# Altium project LimeSDR-PCIe_1v2.PrjPcb (part 4 of 6)

## Sheet 13_Periphs.SchDoc: Peripherals
size A3; Organization: Lime Microsystems; Address1: Surrey Tech Centre; Address2: Guildford GU2 7YG; Address3: Surrey; Address4: United Kingdom; Revision: v1.2; SheetNumber: 13; SheetTotal: 16
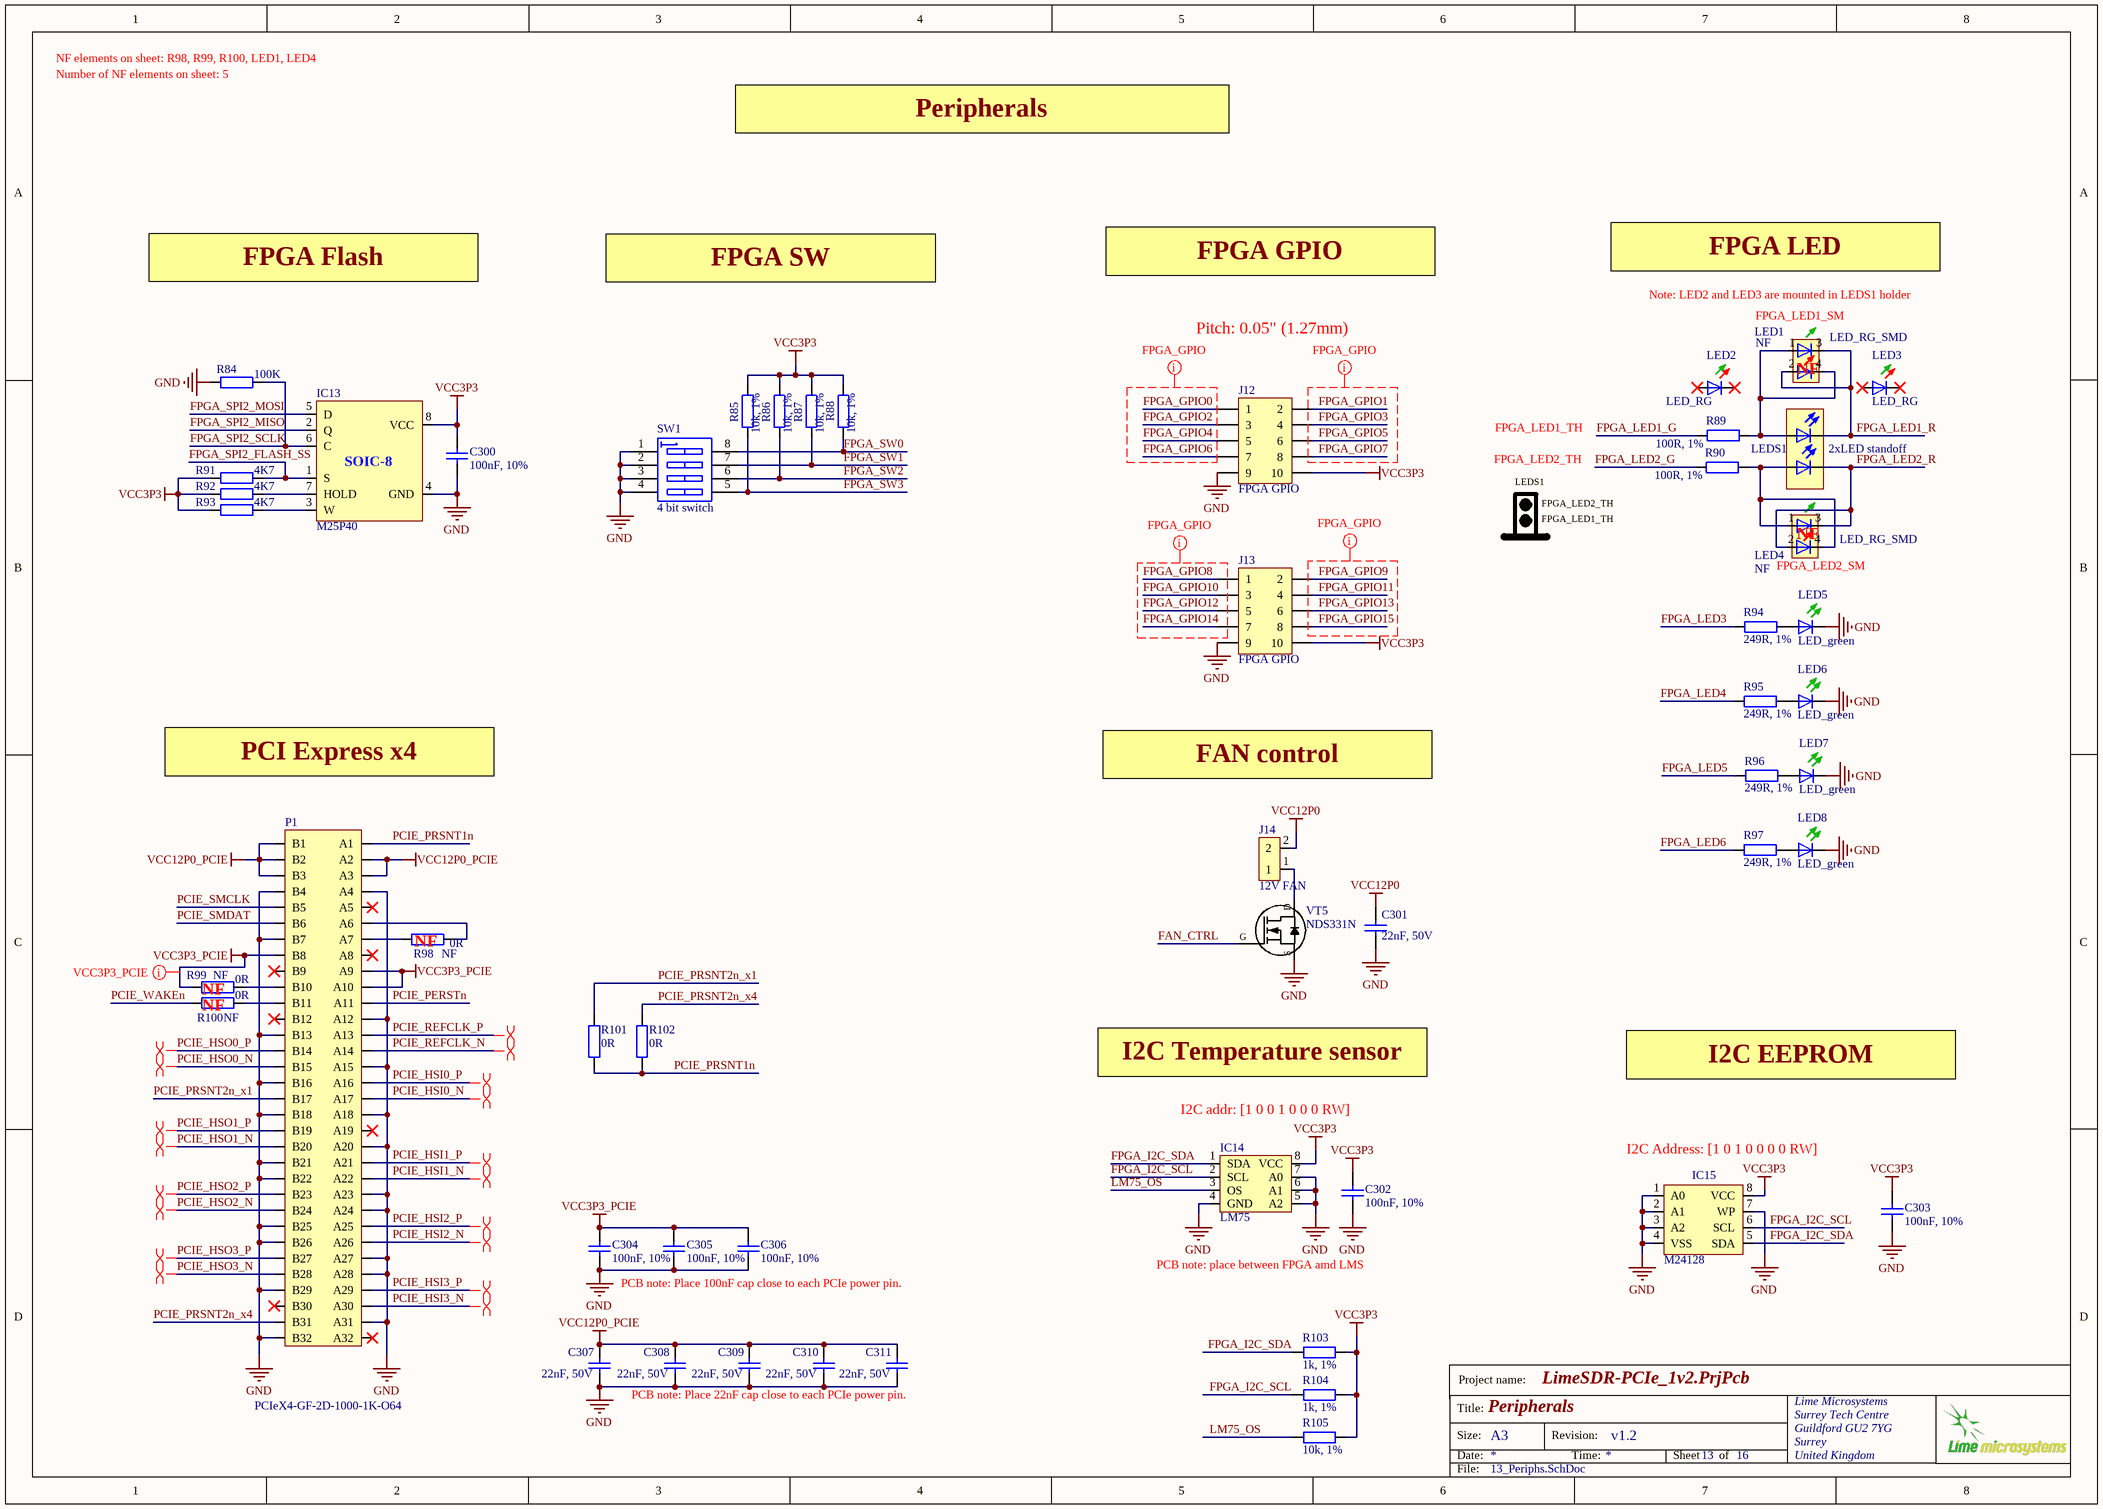
[diagram p13: 13_Periphs.SchDoc]

### Parts
C300  100nF, 10%  [CAP0402]
C301  22nF, 50V  [CAP0402]
C302  100nF, 10%  [CAP0402]
C303  100nF, 10%  [CAP0402]
C304  100nF, 10%  [CAP0402]
C305  100nF, 10%  [CAP0402]
C306  100nF, 10%  [CAP0402]
C307  22nF, 50V  [CAP0402]
C308  22nF, 50V  [CAP0402]
C309  22nF, 50V  [CAP0402]
C310  22nF, 50V  [CAP0402]
C311  22nF, 50V  [CAP0402]
IC13  M25P40  [M25P40-VMN6TPB_SO8N]
IC14  LM75  [HWSON8_LM75]
IC15  M24128  [24FC512]
J12  FPGA GPIO  [SWD_10_pin]
J13  FPGA GPIO  [SWD_10_pin]
J14  12V FAN  [HDR_1x2]
LED1  LED_RG_SMD  Assembly Info: NF  [LED-2x0603]
LED2  LED_RG  (mechanical)
LED3  LED_RG  (mechanical)
LED4  LED_RG_SMD  Assembly Info: NF  [LED-2x0603]
LED5  LED_green  [LED-0603-GREEN]
LED6  LED_green  [LED-0603-GREEN]
LED7  LED_green  [LED-0603-GREEN]
LED8  LED_green  [LED-0603-GREEN]
LEDS1  2xLED standoff  [LED_STANDOFF_H-201C]
P1  PCIeX4-GF-2D-1000-1K-O64  [PCIeX4-GF-2D-1000-1K-O64]  (no BOM)
R84  100K  [RES0402]
R85  10k, 1%  [RES0402]
R86  10k, 1%  [RES0402]
R87  10k, 1%  [RES0402]
R88  10k, 1%  [RES0402]
R89  100R, 1%  [RES0402]
R90  100R, 1%  [RES0402]
R91  4K7  [RES0402]
R92  4K7  [RES0402]
R93  4K7  [RES0402]
R94  249R, 1%  [RES0402]
R95  249R, 1%  [RES0402]
R96  249R, 1%  [RES0402]
R97  249R, 1%  [RES0402]
R98  0R  Assembly Info: NF  [RES0402]
R99  0R  Assembly Info: NF  [RES0402]
R100  0R  Assembly Info: NF  [RES0402]
R101  0R  [RES0402]
R102  0R  [RES0402]
R103  1k, 1%  [RES0402]
R104  1k, 1%  [RES0402]
R105  10k, 1%  [RES0402]
SW1  4 bit switch  [SW_4WAY_SMD_1P27]
VT5  NDS331N  [SOT23-3]

### Nets
GND: C300.2 C301.2 C302.2 C303.2 C304.2 C305.2 C306.2 C307.2 C308.2 C309.2 C310.2 C311.2 IC13.4(GND) IC14.4(GND) IC14.5(A2) IC14.6(A1) IC14.7(A0) IC15.1(A0) IC15.2(A1) IC15.3(A2) IC15.4(VSS) IC15.7(WP) J12.9 J13.9 LED5.K(C) LED6.K(C) LED7.K(C) LED8.K(C) P1.A4 P1.A12 P1.A15 P1.A18 P1.A20 P1.A23 P1.A24 P1.A27 P1.A28 P1.A31 P1.B4 P1.B7 P1.B13 P1.B16 P1.B18 P1.B21 P1.B22 P1.B25 P1.B26 P1.B29 P1.B32 R84.1 SW1.1(A1) SW1.2(A2) SW1.3(A3) SW1.4(A4) VT5.S
VCC3P3: C300.1 C302.1 C303.1 IC13.8(VCC) IC14.8(VCC) IC15.8(VCC) J12.10 J13.10 R85.1 R86.1 R87.1 R88.1 R91.1 R92.1 R93.1 R103.1 R104.1 R105.1
VCC3P3_PCIE: C304.1 C305.1 C306.1 P1.A9 P1.A10 P1.B8 R99.1
VCC12P0: C301.1 J14.2
VCC12P0_PCIE: C307.1 C308.1 C309.1 C310.1 C311.1 P1.A2 P1.A3 P1.B1 P1.B2 P1.B3
FAN_CTRL: VT5.G
FPGA_GPIO0: J12.1
FPGA_GPIO1: J12.2
FPGA_GPIO2: J12.3
FPGA_GPIO3: J12.4
FPGA_GPIO4: J12.5
FPGA_GPIO5: J12.6
FPGA_GPIO6: J12.7
FPGA_GPIO7: J12.8
FPGA_GPIO8: J13.1
FPGA_GPIO9: J13.2
FPGA_GPIO10: J13.3
FPGA_GPIO11: J13.4
FPGA_GPIO12: J13.5
FPGA_GPIO13: J13.6
FPGA_GPIO14: J13.7
FPGA_GPIO15: J13.8
FPGA_I2C_SCL: IC14.2(SCL) IC15.6(SCL) R104.2
FPGA_I2C_SDA: IC14.1(SDA) IC15.5(SDA) R103.2
FPGA_LED1_G: R89.1
FPGA_LED1_R: LED1.2 LED1.3 LEDS1.K1(C)
FPGA_LED2_G: R90.1
FPGA_LED2_R: LED4.2 LED4.3 LEDS1.K2(C)
FPGA_LED3: R94.1
FPGA_LED4: R95.1
FPGA_LED5: R96.1
FPGA_LED6: R97.1
FPGA_SPI2_FLASH_SS: IC13.1(S) R91.2
FPGA_SPI2_MISO: IC13.2(Q)
FPGA_SPI2_MOSI: IC13.5(D)
FPGA_SPI2_SCLK: IC13.6(C) R84.2
FPGA_SW0: R88.2 SW1.8(B1)
FPGA_SW1: R87.2 SW1.7(B2)
FPGA_SW2: R86.2 SW1.6(B3)
FPGA_SW3: R85.2 SW1.5(B4)
LM75_OS: IC14.3(OS) R105.2
PCIE_HSI0_N: P1.A17
PCIE_HSI0_P: P1.A16
PCIE_HSI1_N: P1.A22
PCIE_HSI1_P: P1.A21
PCIE_HSI2_N: P1.A26
PCIE_HSI2_P: P1.A25
PCIE_HSI3_N: P1.A30
PCIE_HSI3_P: P1.A29
PCIE_HSO0_N: P1.B15
PCIE_HSO0_P: P1.B14
PCIE_HSO1_N: P1.B20
PCIE_HSO1_P: P1.B19
PCIE_HSO2_N: P1.B24
PCIE_HSO2_P: P1.B23
PCIE_HSO3_N: P1.B28
PCIE_HSO3_P: P1.B27
PCIE_PERSTn: P1.A11
PCIE_PRSNT1n: P1.A1 R101.1 R102.1
PCIE_PRSNT2n_x1: P1.B17 R101.2
PCIE_PRSNT2n_x4: P1.B31 R102.2
PCIE_REFCLK_N: P1.A14
PCIE_REFCLK_P: P1.A13
PCIE_SMCLK: P1.B5
PCIE_SMDAT: P1.B6
PCIE_WAKEn: R100.1
NetIC13_3: IC13.3(W) R93.2
NetIC13_7: IC13.7(HOLD) R92.2
NetJ14_1: J14.1 VT5.D
NetLED1_1: LED1.1 LED1.4 LEDS1.A1(A) R89.2
NetLED4_1: LED4.1 LED4.4 LEDS1.A2(A) R90.2
NetLED5_A: LED5.A R94.2
NetLED6_A: LED6.A R95.2
NetLED7_A: LED7.A R96.2
NetLED8_A: LED8.A R97.2
NetP1_A6: P1.A6 R98.2
NetP1_A7: P1.A7 R98.1
NetP1_B10: P1.B10 R99.2
NetP1_B11: P1.B11 R100.2

Not connected (* = marked no-connect by the designer): LED2 A* K(C)*; LED3 A* K(C)*; P1 A5* A8* A19* A32* B9* B12* B30*

### Layout directives
net class FPGA_GPIO: FPGA_GPIO0, FPGA_GPIO1, FPGA_GPIO2, FPGA_GPIO3, FPGA_GPIO4, FPGA_GPIO5, FPGA_GPIO6, FPGA_GPIO7, FPGA_GPIO8, FPGA_GPIO9, FPGA_GPIO10, FPGA_GPIO11, FPGA_GPIO12, FPGA_GPIO13, FPGA_GPIO14, FPGA_GPIO15
differential pair: PCIE_HSI0_N, PCIE_HSI0_P, PCIE_HSI1_N, PCIE_HSI1_P, PCIE_HSI2_N, PCIE_HSI2_P, PCIE_HSI3_N, PCIE_HSI3_P, PCIE_HSO0_N, PCIE_HSO0_P, PCIE_HSO1_N, PCIE_HSO1_P, PCIE_HSO2_N, PCIE_HSO2_P, PCIE_HSO3_N, PCIE_HSO3_P, PCIE_REFCLK_N, PCIE_REFCLK_P
net class VCC3P3_PCIE: VCC3P3_PCIE

### Notes on the sheet
- Number of NF elements on sheet: 5
- NF elements on sheet: R98, R99, R100, LED1, LED4
- Peripherals
- FPGA Flash
- FPGA SW
- FPGA GPIO
- FPGA LED
- (near LED1) Note: LED2 and LED3 are mounted in LEDS1 holder
- Pitch: 0.05" (1.27mm)
- (near LED1) FPGA_LED1_SM
- (near LED1) NF
- FPGA_LED1_TH
- FPGA_LED2_TH
- LEDS1
- (near LED4) FPGA_LED2_SM
- (near LED4) NF
- PCI Express x4
- FAN control
- (near R98) NF
- (near R100) NF
- (near R99) NF
- I2C Temperature sensor
- I2C addr: [1 0 0 1 0 0 0 RW]
- I2C EEPROM
- (near IC15) I2C Address: [1 0 1 0 0 0 0 RW]
- PCB note: Place 100nF cap close to each PCIe power pin.
- PCB note: place between FPGA amd LMS
- PCB note: Place 22nF cap close to each PCIe power pin.
- Project name:
- Title:
- Size:
- Date:
- A3
- Revision:
- Time:
- Sheet
- of
- File:
- (in symbol M25P40) SOIC-8

### Library data of the parts
C300 C302 C303 = Cap_0603: as C119 on sheet 10_FPGA_misc; Supplier 1: Mouser; Supplier Part Number 1: 81-GRM155R71C104KA88; Tolerance: 10 %; Case Code - in: 0402; Manufacturer: Murata Electronics; Category: Multilayer Ceramic Capacitors MLCC - SMD/SMT; Value: 100nF, 10%; Manufacturer Part Number: GRM155R71C104KA88D; Maximum Operating Temperature: + 125 C; Minimum Operating Temperature: - 55 C; Minimum Order Quantity: 1; Operating Temperature Range: - 55 C to + 125 C; Package / Case: 0402 (1005 metric); Packaging: Reel; Product: General Type MLCCs; Product Category: Low & Medium Capacitance SMD Ceramic Chip Capacitors; Reeling: True; RoHS - Mouser: Y; RoHS: RoHS Compliant; Series: GRM; Standard Pack Qty: 10000; Termination Style: SMD/SMT
C301 C307-C311 = Cap_0402: Manufacturer: Kemet; Manufacturer Part Number 1: C0402C223K5RACTU; Part Description: 0.022µF ±10% 50V X7R Ceramic Capacitor -55°C ~ 125°C Surface Mount, MLCC 0402 (1005 Metric) 0.039" L x 0.020" W (1.00mm x 0.50mm); Temperature Coefficient: X7R; Tolerance: ±10%; Capacitance: 0.022µF; Value: 22nF, 50V; Supplier 1: Digi-Key; Supplier Part Number 1: 399-7780-1-ND; Ratings: -; Packaging: Cut Tape (CT); Category: Capacitors; Size / Dimension: 0.039" L x 0.020" W (1.00mm x 0.50mm); RoHS: RoHS Compliant; Operating Temperature: -55°C ~ 125°C; Mounting Type: Surface Mount, MLCC; Applications: General Purpose; Voltage - Rated: 50V; Thickness (Max): 0.022" (0.55mm); Features: -; Height - Seated (Max): -; Lead Style: -; Package / Case: 0402 (1005 Metric); Lead Spacing: -
C304-C306 = Cap_0603: Part Description: 0.10µF ±10% 16V X7R Ceramic Capacitor -55°C ~ 125°C Surface Mount, MLCC 0402 (1005 Metric) 0.039" L x 0.020" W (1.00mm x 0.50mm); Manufacturer Part Number 1: GRM155R71C104KA88D; Brand: Murata Electronics; Type: General Purpose MLCC; Capacitance: 0.1 uF; Temperature Coefficient / Code: +/- 15 %; Voltage Rating DC: 16 V; Supplier 1: Mouser; Supplier Part Number 1: 81-GRM155R71C104KA88; Tolerance: 10 %; Case Code - in: 0402; Manufacturer: Murata Electronics; Category: Multilayer Ceramic Capacitors MLCC - SMD/SMT; Value: 100nF, 10%; Manufacturer Part Number: GRM155R71C104KA88D; Maximum Operating Temperature: + 125 C; Minimum Operating Temperature: - 55 C; Minimum Order Quantity: 1; Operating Temperature Range: - 55 C to + 125 C; Package / Case: 0402 (1005 metric); Packaging: Reel; Product: General Type MLCCs; Product Category: Low & Medium Capacitance SMD Ceramic Chip Capacitors; Reeling: True; RoHS - Mouser: Y; RoHS: RoHS Compliant; Series: GRM; Standard Pack Qty: 10000; Termination Style: SMD/SMT
IC13 = M25P40: Manufacturer: Micron Technology Inc; Part Description: IC FLASH 4MBIT 75MHZ 8SO; Manufacturer Part Number 1: M25P40-VMN6TPB TR; Memory Size: 4M (512K x 8); Voltage - Supply: 2.3 V ~ 3.6 V; Supplier 1: Digi-Key; Supplier Device Package: 8-SO; Supplier Part Number 1: M25P40-VMN6TPBTR-ND
IC14 = LM75: Manufacturer: NXP Semiconductors; Manufacturer Part Number: LM75BTP,147; Part Description: SENSOR TEMPERATURE I2C 8HWSON; Sensing Temperature - Local: -55°C ~ 125°C; Output Type: I²C; Accuracy - Highest (Lowest): ±2°C (±3°C); Voltage - Supply: 2.8 V ~ 5.5 V; Test Condition: -25°C ~ 100°C (-55°C ~ 125°C); Sensor Type: Digital, Local; Resolution: 10 b; Supplier 1: Digi-Key; Operating Temperature: -55°C ~ 125°C; Features: Output Switch, Programmable Limit, Shutdown Mode; Supplier Device Package: 8-HWSON (2x3); Sensing Temperature - Remote: -; Category: Sensors, Transducers; Packaging: Tape & Reel (TR); RoHS: RoHS Compliant; Package / Case: 8-WFDFN Exposed Pad; Supplier Part Number 1: 568-9815-2-ND
IC15 = 24FC64F: Part Description: IC EEPROM 128KBIT 1MHZ 8TSSOP; Manufacturer: STMicroelectronics; Manufacturer Part Number 1: M24128-DRDW8TP/K; Format - Memory: EEPROMs - Serial; Memory Type: EEPROM; Memory Size: 128K (16K x 8); Speed: 1MHz; Interface: I²C, 2-Wire Serial; Voltage - Supply: 1.8 V ~ 5.5 V; Supplier 1: Digi-Key; Supplier Part Number 1: 497-15336-1-ND; RoHS: RoHS Compliant; Category: Integrated Circuits (ICs); Stock 1: 1677; Pricing 1: 1=0.47, 10=0.464, 100=0.3805, 500=0.36996, 1000=0.36005 (USD); Packaging: Cut Tape (CT); Part Status: Active; Operating Temperature: -40°C ~ 105°C (TA); Package / Case: 8-TSSOP (0.173", 4.40mm Width); Supplier Device Package: 8-TSSOP; ComponentLink1URL: http://www.st.com/content/ccc/resource/technical/document/datasheet/5c/f3/4b/70/8e/63/48/95/DM00149696.pdf/files/DM00149696.pdf/jcr:content/translations/en.DM00149696.pdf; ComponentLink1Description: http://www.st.com/content/ccc/resource/technical/document/datasheet/5c/f3/4b/70/8e/63/48/95/DM00149696.pdf/files/DM00149696.pdf/jcr:content/translations/en.DM00149696.pdf
J12 J13 = Header 5X2_SWD: Header, 5-Pin, Dual row; Manufacturer Part Number 1: M50-3600542; Manufacturer: Harwin Inc; Part Description: CONN HDR 1.27MM SMD AU 10POS; Number of Positions: 10; Molding Height Above Board: 0.039" (1.00mm); Row Spacing: 0.050" (1.27mm); Number of Positions Loaded: All; Connector Type: Unshrouded; Supplier 1: Digi-Key; Contact Mating Length: 0.118" (3.00mm); Category: Connectors, Interconnects; Color: Black; RoHS: RoHS Compliant; Number of Rows: 2; Contact Finish Thickness: 3µin (0.08µm); Height Stacking (Mating): -; Contact Finish: Gold; Termination: Solder; Mounting Type: Surface Mount; Pitch: 0.050" (1.27mm); Features: -; Packaging: Bulk; Supplier Part Number 1: 952-1389-ND
J14 = Jumper: Manufacturer Part Number 1: 961102-6404-AR; Part Description: 2 Positions Header, Unshrouded Connector 0.100" (2.54mm) Through Hole Gold; Manufacturer: 3M; Connector Type: Header, Unshrouded; Supplier 1: Digi-Key; Supplier Part Number 1: 3M9447-ND; Contact Type: Male Pin; Color: Black; Mounting Type: Through Hole; Category: Connectors, Interconnects; Contact Finish: Gold
LED1 LED4 = LED_green_red_SMD: Manufacturer Part Number 1: HSMF-C165; Manufacturer: Avago Technologies US Inc.; Part Description: LED GREEN/RED DIFFUSED 0603 SMD; Millicandela Rating: 15mcd Green, 10mcd Red; Lens Transparency: Diffused; Lens Color: White; Lens Style/Size: Rectangle with Flat Top, 1.60mm x 0.80mm; Wavelength - Peak: 570nm Green, 636nm Red; Wavelength - Dominant: 572nm Green, 621nm Red; Viewing Angle: 120°; Voltage - Forward (Vf) (Typ): 2.2V Green, 1.95V Red; Current - Test: 20mA; Color: Green, Red; Supplier 1: Digi-Key; Height (Max): 0.50mm; Packaging: Cut Tape (CT); Category: Optoelectronics; Mounting Type: Surface Mount; Package / Case: 0603 (1608 Metric); Size / Dimension: 1.60mm L x 0.80mm W; Supplier Device Package: *; RoHS: RoHS Compliant; Supplier Part Number 1: 516-1419-1-ND
LED2 LED3 = LED_green_red: Manufacturer Part Number 1: 4301F1/5; Manufacturer: Visual Communications Company - VCC; Part Description: LED GRN/RED DIFF 3MM ROUND T/H; Voltage - Forward (Vf) (Typ): 2.1V Green, 1.8V Red; Lens Color: White; Lens Style/Size: Round with Domed Top, 3mm (T-1), 2.90mm; Millicandela Rating: 12.6mcd Green, 3.7mcd Red; Color: Green, Red; Viewing Angle: 100°; Lens Transparency: Diffused; Current - Test: 20mA Green, 20mA Red; Wavelength - Peak: 565nm Green, 660nm Red; Supplier 1: Digi-Key; Supplier Part Number 1: 4301F1/5-ND; RoHS: RoHS Compliant; Packaging: Bulk; Package / Case: Radial; Mounting Type: Through Hole; Wavelength - Dominant: -; Supplier Device Package: T-1; Size / Dimension: -; Category: Optoelectronics; Height (Max): 5.44mm
LED5-LED8 = LED_green: Part Description: LED GREEN DIFFUSED 0603 SMD; Manufacturer: Broadcom Limited; Current - Test: 20mA; Voltage - Forward (Vf) (Typ): 2.2V; Color: Green; Supplier 1: Digi-Key; Supplier Part Number 1: 516-1425-2-ND; Category: Optoelectronics; Package / Case: 0603 (1608 Metric)
LEDS1 = LEDx2_STANDOFF: Manufacturer Part Number 1: H-201C; Manufacturer: Bivar Inc.; Part Description: LED HOLDER RA 3MM 2LD NYL BK; LED: T1; Supplier 1: Digi-Key; Supplier Part Number 1: 492-1790-ND; Category: Optoelectronics; RoHS: RoHS Compliant; Color: Black; Length: 0.380" (9.65mm); Material: Nylon
R84 = Res_0402: Manufacturer Part Number 1: ERJ-2GEJ104X; Manufacturer: Panasonic Electronic Components; Part Description: RES SMD 100K OHM 5% 1/10W 0402; Tolerance: ±5%; Temperature Coefficient: ±200ppm/°C; Power (Watts): 0.1W, 1/10W; Value: 100K; Supplier 1: Digi-Key; Supplier Part Number 1: P100KJCT-ND; Resistance (Ohms): 100k; Composition: Thick Film; Features: Automotive AEC-Q200; Number of Terminations: 2; Height: 0.016" (0.40mm); RoHS: RoHS Compliant; Package / Case: 0402 (1005 Metric); Packaging: Cut Tape (CT); Size / Dimension: 0.039" L x 0.020" W (1.00mm x 0.50mm); Supplier Device Package: 0402; Operating Temperature: -55°C ~ 155°C; Category: Resistors
R85-R88 R105 = Res_0402: as R56 on sheet 10_FPGA_misc; Value: 10k, 1%; Supplier 1: Digi-Key; Supplier Part Number 1: 311-10.0KLRTR-ND; Resistance (Ohms): 10k; Packaging: Tape & Reel (TR); RoHS: RoHS Compliant; Package / Case: 0402 (1005 Metric); Tolerance: ±1%; Operating Temperature: -55°C ~ 155°C; Size / Dimension: 0.039" L x 0.020" W (1.00mm x 0.50mm); Number of Terminations: 2; Category: Resistors; Height: 0.016" (0.40mm); Supplier Device Package: 0402; Features: Moisture Resistant; Composition: Thick Film
R89 R90 = Res_0402: Manufacturer Part Number 1: RMCF0402FT100R; Manufacturer: Stackpole Electronics Inc.; Part Description: RES SMD 100 OHM 1% 1/16W 0402; Power (Watts): 0.063W, 1/16W; Temperature Coefficient: ±100ppm/°C; Resistance (Ohms): 100; Value: 100R, 1%; Supplier 1: Digi-Key; Supplier Part Number 1: RMCF0402FT100RDKR-ND; Packaging: Digi-Reel®; Composition: Thick Film; Number of Terminations: 2; Package / Case: 0402 (1005 Metric); RoHS: RoHS Compliant; Category: Resistors; Size / Dimension: 0.039" L x 0.020" W (1.00mm x 0.50mm); Tolerance: ±1%; Supplier Device Package: 0402; Features: -; Height: 0.016" (0.40mm); Operating Temperature: -55°C ~ 155°C
R91-R93 = Res_0402: Manufacturer Part Number 1: RMCF0402JT4K70; Part Description: RES SMD 4.7K OHM 5% 1/16W 0402; Manufacturer: Stackpole Electronics Inc.; Temperature Coefficient: ±100ppm/°C; Resistance(Ohms): 4.7k; Tolerance: ±5%; Supplier 1: Digi-Key; Composition: Thick Film; Supplier Device Package: 0402; Supplier: Digi-Key; Supplier Part Number 1: RMCF0402JT4K70TR-ND; Category: Resistors; Value: 4K7
R94-R97 = Res_0402: Manufacturer Part Number 1: RMCF0402FT249R; Manufacturer: Stackpole Electronics Inc; Part Description: RMCF0402FT249RCT-ND; Resistance (Ohms): 249; Power (Watts): 0.063W, 1/16W; Temperature Coefficient: ±100ppm/°C; Value: 249R, 1%; Supplier 1: Digi-Key; Supplier Part Number 1: RMCF0402FT249RCT-ND; Package / Case: 0402 (1005 Metric); Features: -; Size / Dimension: 0.039" L x 0.020" W (1.00mm x 0.50mm); Category: Resistors; Operating Temperature: -55°C ~ 155°C; Packaging: Cut Tape (CT); Tolerance: ±1%; Supplier Device Package: 0402; RoHS: RoHS Compliant; Composition: Thick Film; Number of Terminations: 2; Height: 0.016" (0.40mm)
R98-R102 = Res_0402: Manufacturer: Yageo; Part Description: RES SMD 0.0OHM JUMPER 1/16W 0402; Supplier 1: Digi-Key; Supplier Part Number 1: 311-0.0JRTR-ND; Composition: Thick Film; Package / Case: 0402 (1005 Metric); Category: Resistors; Value: 0R
R103 R104 = Res_0402: as R62 on sheet 10_FPGA_misc; Value: 1k, 1%; Supplier 1: Digi-Key; Supplier Part Number 1: RMCF0402FT1K00TR-ND; Package / Case: 0402 (1005 Metric); Supplier Device Package: 0402; Height: 0.016" (0.40mm); Size / Dimension: 0.039" L x 0.020" W (1.00mm x 0.50mm); Number of Terminations: 2; Packaging: Cut Tape (CT); Category: Resistors; Composition: Thick Film; Resistance (Ohms): 1k; Tolerance: ±1%; Features: Moisture Resistant; Operating Temperature: -55°C ~ 155°C; RoHS: RoHS Compliant
SW1 = SW_SM_4bit: Manufacturer Part Number 1: A6H-4101; Manufacturer: Omron Electronics Inc-EMC Div; Part Description: SWITCH DIP 4POLES STD SMD 24V; Pitch: 0.050" (1.27mm), Half; Mechanical Life: 1,000 Cycles; Washable: No; Current Rating: 25mA; Number of Positions: 4; Voltage Rating: 24VDC; Actuator Level: Flush, Recessed; Circuit: SPST; Actuator Type: Slide (Standard); Supplier 1: Digi-Key; Height Above Board: 0.061" (1.55mm); RoHS: RoHS Compliant; Termination Style: Gull Wing; Electrical Life: 1,000 Cycles; Length: 0.248" (6.31mm); Category: Switches; Operating Temperature: -20°C ~ 70°C; Body Material: -; Contact Material: -; Features: -; Mounting Type: Surface Mount; Contact Finish: -; Packaging: Tube; Supplier Part Number 1: SW1080-ND
VT5 = NDS331N: Part Description: MOSFET N-CH 20V 1.3A SSOT3; Manufacturer: FAIRCHILD SEMICONDUCTOR; Gate Charge (Qg) @ Vgs: 5nC @ 4.5V; Power - Max: 460mW; Current - Continuous Drain (Id) @ 25°C: 1.3A (Ta); Input Capacitance (Ciss) @ Vds: 162pF @ 10V; FET Type: MOSFET N-Channel, Metal Oxide; Drain to Source Voltage (Vdss): 20V; FET Feature: Logic Level Gate; Supplier Device Package: 3-SSOT; Category: Discrete Semiconductor Products; Mounting Type: Surface Mount; Package / Case: TO-236-3, SC-59, SOT-23-3; Supplier 1: Digi-Key; Supplier Part Number 1: NDS331NCT-ND; Manufacturer Part Number: NDS331N

## Sheet 14_Clocks_1.SchDoc: Clocks 1
size A3; Organization: Lime Microsystems; Address1: Surrey Tech Centre; Address2: Guildford GU2 7YG; Address3: Surrey; Address4: United Kingdom; Revision: v1.2; SheetNumber: 14; SheetTotal: 16
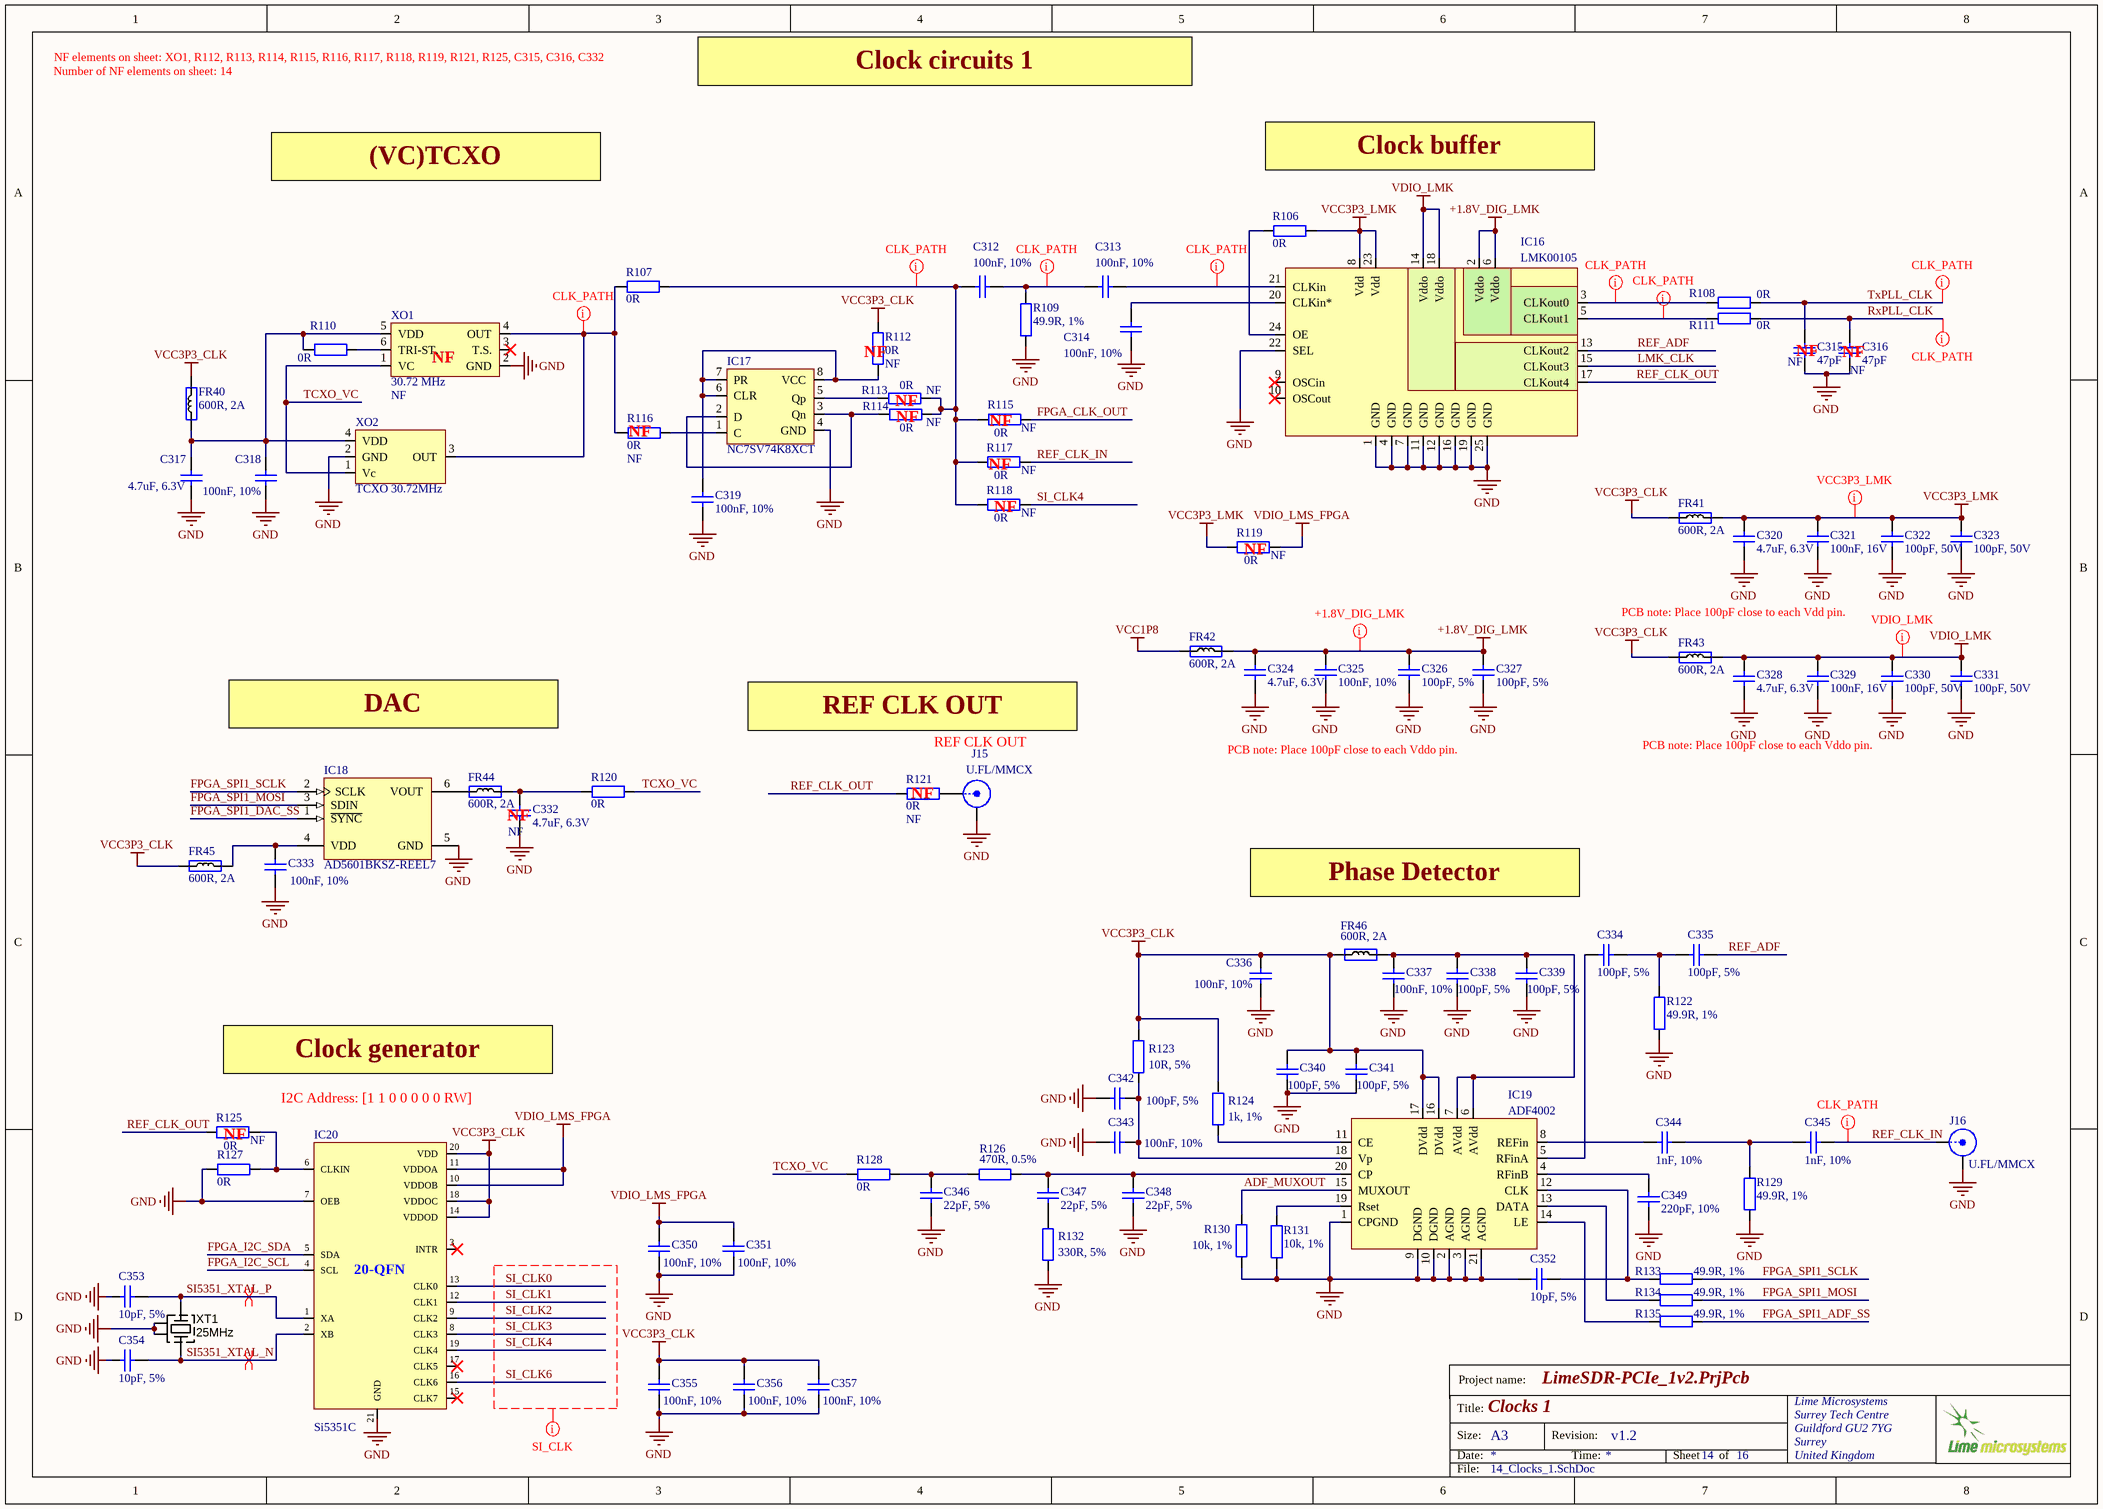
[diagram p14: 14_Clocks_1.SchDoc]

### Parts
C312  100nF, 10%  [CAP0402]
C313  100nF, 10%  [CAP0402]
C314  100nF, 10%  [CAP0402]
C315  47pF  Assembly Info: NF  [CAP0402]
C316  47pF  Assembly Info: NF  [CAP0402]
C317  4.7uF, 6.3V  [CAP0402]
C318  100nF, 10%  [CAP0402]
C319  100nF, 10%  [CAP0402]
C320  4.7uF, 6.3V  [CAP0402]
C321  100nF, 16V  [CAP0402]
C322  100pF, 50V  [CAP0402]
C323  100pF, 50V  [CAP0402]
C324  4.7uF, 6.3V  [CAP0402]
C325  100nF, 10%  [CAP0402]
C326  100pF, 5%  [CAP0402]
C327  100pF, 5%  [CAP0402]
C328  4.7uF, 6.3V  [CAP0402]
C329  100nF, 16V  [CAP0402]
C330  100pF, 50V  [CAP0402]
C331  100pF, 50V  [CAP0402]
C332  4.7uF, 6.3V  Assembly Info: NF  [CAP0402]
C333  100nF, 10%  [CAP0402]
C334  100pF, 5%  [CAP0402]
C335  100pF, 5%  [CAP0402]
C336  100nF, 10%  [CAP0402]
C337  100nF, 10%  [CAP0402]
C338  100pF, 5%  [CAP0402]
C339  100pF, 5%  [CAP0402]
C340  100pF, 5%  [CAP0402]
C341  100pF, 5%  [CAP0402]
C342  100pF, 5%  [CAP0402]
C343  100nF, 10%  [CAP0402]
C344  1nF, 10%  [CAP0402]
C345  1nF, 10%  [CAP0402]
C346  22pF, 5%  [CAP0402]
C347  22pF, 5%  [CAP0402]
C348  22pF, 5%  [CAP0402]
C349  220pF, 10%  [CAP0402]
C350  100nF, 10%  [CAP0402]
C351  100nF, 10%  [CAP0402]
C352  10pF, 5%  [CAP0402]
C353  10pF, 5%  [CAP0402]
C354  10pF, 5%  [CAP0402]
C355  100nF, 10%  [CAP0402]
C356  100nF, 10%  [CAP0402]
C357  100nF, 10%  [CAP0402]
FR40  600R, 2A  [RES0805]
FR41  600R, 2A  [RES0805]
FR42  600R, 2A  [RES0805]
FR43  600R, 2A  [RES0805]
FR44  600R, 2A  [RES0805]
FR45  600R, 2A  [RES0805]
FR46  600R, 2A  [RES0805]
IC16  LMK00105  [LMK00105SQ]
IC17  NC7SV74K8XCT  [NC7SV74K8XCT]
IC18  AD5601BKSZ-REEL7  [AD5601_SOT23-6]
IC19  ADF4002  [ADF4002]
IC20  Si5351C  [Si5351C_20QFN]
J15  U.FL/MMCX  [MMCX_UFL_conn_u]
J16  U.FL/MMCX  [MMCX_UFL_conn_u]
R106  0R  [RES0402]
R107  0R  [RES0402]
R108  0R  [RES0402]
R109  49.9R, 1%  [RES0402]
R110  0R  [RES0402]
R111  0R  [RES0402]
R112  0R  Assembly Info: NF  [RES0402]
R113  0R  Assembly Info: NF  [RES0402]
R114  0R  Assembly Info: NF  [RES0402]
R115  0R  Assembly Info: NF  [RES0402]
R116  0R  Assembly Info: NF  [RES0402]
R117  0R  Assembly Info: NF  [RES0402]
R118  0R  Assembly Info: NF  [RES0402]
R119  0R  Assembly Info: NF  [RES0402]
R120  0R  [RES0402]
R121  0R  Assembly Info: NF  [RES0402]
R122  49.9R, 1%  [RES0402]
R123  10R, 5%  [RES0402]
R124  1k, 1%  [RES0402]
R125  0R  Assembly Info: NF  [RES0402]
R126  470R, 0.5%  [RES0402]
R127  0R  [RES0402]
R128  0R  [RES0402]
R129  49.9R, 1%  [RES0402]
R130  10k, 1%  [RES0402]
R131  10k, 1%  [RES0402]
R132  330R, 5%  [RES0402]
R133  49.9R, 1%  [RES0402]
R134  49.9R, 1%  [RES0402]
R135  49.9R, 1%  [RES0402]
XO1  30.72 MHz  Assembly Info: NF  [RAKON_RPT7050A]
XO2  TCXO 30.72MHz  [RAKON_TXCO]
XT1  25MHz  [CRYSTAL_4-LCC]

### Nets
+1.8V_DIG_LMK: C324.2 C325.2 C326.2 C327.2 FR42.2 IC16.2(Vddo) IC16.6(Vddo)
GND: C314.1 C315.1 C316.1 C317.1 C318.1 C319.1 C320.1 C321.1 C322.1 C323.1 C324.1 C325.1 C326.1 C327.1 C328.1 C329.1 C330.1 C331.1 C332.1 C333.2 C336.1 C337.1 C338.2 C339.2 C340.2 C341.2 C342.1 C343.2 C346.1 C348.1 C349.2 C350.2 C351.2 C352.1 C353.1 C354.1 C355.2 C356.2 C357.2 IC16.1(GND) IC16.4(GND) IC16.7(GND) IC16.11(GND) IC16.12(GND) IC16.16(GND) IC16.19(GND) IC16.22(SEL) IC16.25(GND) IC17.4(GND) IC18.5(GND) IC19.1(CPGND) IC19.2(AGND) IC19.3(AGND) IC19.9(DGND) IC19.10(DGND) IC19.21(AGND) IC20.7(OEB) IC20.21(GND) J15.2(Y) J16.2(Y) R109.1 R122.1 R127.2 R129.1 R130.2 R131.2 R132.1 XO1.2(GND) XO2.2(GND) XT1.2(GND) XT1.4(GND)
VCC1P8: FR42.1
VCC3P3_CLK: C336.2 C340.1 C341.1 C355.1 C356.1 C357.1 FR40.2 FR41.1 FR43.1 FR45.1 FR46.1 IC19.16(DVdd) IC19.17(DVdd) IC20.14(VDDOD) IC20.18(VDDOC) IC20.20(VDD) R112.1 R123.2 R124.2
VCC3P3_LMK: C320.2 C321.2 C322.2 C323.2 FR41.2 IC16.8(Vdd) IC16.23(Vdd) R106.2 R119.1
VDIO_LMK: C328.2 C329.2 C330.2 C331.2 FR43.2 IC16.14(Vddo) IC16.18(Vddo)
VDIO_LMS_FPGA: C350.1 C351.1 IC20.10(VDDOB) IC20.11(VDDOA) R119.2
ADF_MUXOUT: IC19.15(MUXOUT) R130.1
FPGA_CLK_OUT: R115.1
FPGA_I2C_SCL: IC20.4(SCL)
FPGA_I2C_SDA: IC20.5(SDA)
FPGA_SPI1_ADF_SS: R135.1
FPGA_SPI1_DAC_SS: IC18.1(~{SYNC})
FPGA_SPI1_MOSI: IC18.3(SDIN) R134.1
FPGA_SPI1_SCLK: IC18.2(SCLK) R133.1
LMK_CLK: IC16.15(CLKout3)
REF_ADF: C335.2 IC16.13(CLKout2)
REF_CLK_IN: C345.1 J16.1(X) R117.2
REF_CLK_OUT: IC16.17(CLKout4) R121.2 R125.1
RxPLL_CLK: C316.2 R111.1
SI5351_XTAL_N: C354.2 IC20.2(XB) XT1.3(X)
SI5351_XTAL_P: C353.2 IC20.1(XA) XT1.1(X)
SI_CLK0: IC20.13(CLK0)
SI_CLK1: IC20.12(CLK1)
SI_CLK2: IC20.9(CLK2)
SI_CLK3: IC20.8(CLK3)
SI_CLK4: IC20.19(CLK4) R118.2
SI_CLK6: IC20.16(CLK6)
TCXO_VC: R120.1 R128.2 XO1.1(VC) XO2.1(Vc)
TxPLL_CLK: C315.2 R108.1
NetC312_1: C312.1 C313.2 R109.2
NetC312_2: C312.2 R107.1 R113.1 R114.1 R115.2 R117.1 R118.1
NetC313_1: C313.1 IC16.21(CLKin)
NetC314_2: C314.2 IC16.20(CLKin*)
NetC317_2: C317.2 C318.2 FR40.1 R110.2 XO1.5(VDD) XO2.4(VDD)
NetC319_2: C319.2 IC17.6(CLR) IC17.7(PR) IC17.8(VCC) R112.2
NetC332_2: C332.2 FR44.2 R120.2
NetC333_1: C333.1 FR45.2 IC18.4(VDD)
NetC334_1: C334.1 IC19.5(RFinA)
NetC334_2: C334.2 C335.1 R122.2
NetC337_2: C337.2 C338.1 C339.1 FR46.2 IC19.6(AVdd) IC19.7(AVdd)
NetC342_2: C342.2 C343.1 IC19.18(Vp) R123.1
NetC344_1: C344.1 C345.2 R129.2
NetC344_2: C344.2 IC19.8(REFin)
NetC346_2: C346.2 R126.2 R128.1
NetC347_1: C347.1 R132.2
NetC347_2: C347.2 C348.2 IC19.20(CP) R126.1
NetC349_1: C349.1 IC19.4(RFinB)
NetC352_2: C352.2 IC19.12(CLK) R133.2
NetFR44_1: FR44.1 IC18.6(VOUT)
NetIC16_3: IC16.3(CLKout0) R108.2
NetIC16_5: IC16.5(CLKout1) R111.2
NetIC16_24: IC16.24(OE) R106.1
NetIC17_1: IC17.1(C) R116.1
NetIC17_2: IC17.2(D) IC17.3(Qn) R114.2
NetIC17_5: IC17.5(Qp) R113.2
NetIC19_11: IC19.11(CE) R124.1
NetIC19_13: IC19.13(DATA) R134.2
NetIC19_14: IC19.14(LE) R135.2
NetIC19_19: IC19.19(Rset) R131.1
NetIC20_6: IC20.6(CLKIN) R125.2 R127.1
NetJ15_1: J15.1(X) R121.1
NetR107_2: R107.2 R116.2 XO1.4(OUT) XO2.3(OUT)
NetR110_1: R110.1 XO1.6(TRI-ST.)

Not connected (* = marked no-connect by the designer): IC16 9(OSCin)* 10(OSCout)*; IC20 3(INTR)* 15(CLK7)* 17(CLK5)*; XO1 3(T.S.)*

### Layout directives
net class CLK_PATH: NetC312_1, NetC312_2, NetC313_1, NetIC16_3, NetIC16_5, NetR107_2, REF_CLK_IN, RxPLL_CLK, TxPLL_CLK
net class SI_CLK: SI_CLK0, SI_CLK1, SI_CLK2, SI_CLK3, SI_CLK4, SI_CLK6
differential pair: SI5351_XTAL_N, SI5351_XTAL_P
net class +1.8V_DIG_LMK: +1.8V_DIG_LMK
net class VCC3P3_LMK: VCC3P3_LMK
net class VDIO_LMK: VDIO_LMK

### Notes on the sheet
- Number of NF elements on sheet: 14
- NF elements on sheet: XO1, R112, R113, R114, R115, R116, R117, R118, R119, R121, R125, C315, C316, C332
- Clock circuits 1
- (VC)TCXO
- Clock buffer
- (near XO1) NF
- (near R112) NF
- (near C315) NF
- (near C316) NF
- (near R116) NF
- NF
- (near R114) NF
- (near R115) NF
- (near R117) NF
- (near R118) NF
- (near R119) NF
- PCB note: Place 100pF close to each Vdd pin.
- DAC
- REF CLK OUT
- PCB note: Place 100pF close to each Vddo pin.
- (near C332) NF
- (near R121) NF
- Phase Detector
- Clock generator
- I2C Address: [1 1 0 0 0 0 0 RW]
- (near R125) NF
- Project name:
- Title:
- Size:
- Date:
- A3
- Revision:
- Time:
- Sheet
- of
- File:
- (in symbol Si5351C) 20-QFN

### Library data of the parts
C312-C314 C318 C319 C325 C336 C337 C343 = Cap_0402: Manufacturer: Murata Electronics; Manufacturer Part Number: GRM155R71C104KA88D; Part Description: 0.10µF ±10% 16V X7R Ceramic Capacitor -55°C ~ 125°C Surface Mount, MLCC 0402 (1005 Metric) 0.039" L x 0.020" W (1.00mm x 0.50mm); Voltage Rating DC: 16 V; Type: General Purpose MLCC; Capacitance: 0.1 uF; Case Length: 1 mm; Dielectric: X7R; Case Height: 0.5 mm; Temperature Coefficient / Code: +/- 15 %; Value: 100nF, 10%; Supplier 1: Mouser; Supplier Part Number 1: 81-GRM155R71C104KA88; Case Code - in: 0402; RoHS: RoHS Compliant; Operating Temperature Range: - 55 C to + 125 C; Series: GRM; Termination Style: SMD/SMT; Tolerance: 10 %; Package / Case: 0402 (1005 metric); Maximum Operating Temperature: + 125 C; Case Code - mm: 1005; Minimum Operating Temperature: - 55 C; Product Category: Low & Medium Capacitance SMD Ceramic Chip Capacitors; Packaging: Reel; Product: General Type MLCCs; Category: Multilayer Ceramic Capacitors MLCC - SMD/SMT; Brand: Murata Electronics; Case Width: 0.5 mm; RoHS - Mouser: Y; Standard Pack Qty: 10000; Minimum Order Quantity: 1; Reeling: True; Manufacturer Part Number 1: GRM155R71C104KA88D
C315 C316 = Cap_0402: Manufacturer Part Number 1: C1005C0G1H470F050BA; Manufacturer: TDK Corporation; Part Description: 47pF ±1% 50V C0G, NP0 Ceramic Capacitor -55°C ~ 125°C Surface Mount, MLCC 0402 (1005 Metric) 0.039" L x 0.020" W (1.00mm x 0.50mm); Voltage - Rated: 50V; Temperature Coefficient: C0G, NP0; Tolerance: ±1%; Value: 47pF; Supplier 1: Digi-Key; Supplier Part Number 1: 445-5361-1-ND; Package / Case: 0402 (1005 Metric); Lead Spacing: -; Ratings: -; Mounting Type: Surface Mount, MLCC; Operating Temperature: -55°C ~ 125°C; Thickness (Max): 0.022" (0.55mm); Capacitance: 47pF; Packaging: Cut Tape (CT); Features: -; Applications: General Purpose; Lead Style: -; Size / Dimension: 0.039" L x 0.020" W (1.00mm x 0.50mm); Height - Seated (Max): -; RoHS: RoHS Compliant; Category: Capacitors
C317 C320 C324 C328 C332 = Cap_0402: Manufacturer Part Number 1: GRM155R60J475ME87D; Manufacturer: Murata Electronics North America; Part Description: 4.7µF ±20% 6.3V X5R Ceramic Capacitor -55°C ~ 85°C Surface Mount, MLCC 0402 (1005 Metric) 0.039" L x 0.020" W (1.00mm x 0.50mm); Temperature Coefficient: X5R; Capacitance: 4.7µF; Tolerance: ±20%; Value: 4.7uF, 6.3V; Supplier 1: Digi-Key; Supplier Part Number 1: 490-5408-1-ND; Category: Capacitors; Voltage - Rated: 6.3V; Thickness (Max): 0.022" (0.55mm); Applications: General Purpose; Package / Case: 0402 (1005 Metric); Size / Dimension: 0.039" L x 0.020" W (1.00mm x 0.50mm); Features: Derating Recommended; Mounting Type: Surface Mount, MLCC; Ratings: -; Lead Style: -; Operating Temperature: -55°C ~ 85°C; Lead Spacing: -; RoHS: RoHS Compliant; Height - Seated (Max): -; Packaging: Cut Tape (CT)
C321 C329 = Cap_0402: Manufacturer: Murata Electronics; Manufacturer Part Number: GRM155R71C104KA88D; Part Description: 0.10µF ±10% 16V X7R Ceramic Capacitor -55°C ~ 125°C Surface Mount, MLCC 0402 (1005 Metric) 0.039" L x 0.020" W (1.00mm x 0.50mm); Tolerance: 10 %; Type: General Purpose MLCC; Capacitance: 0.1 uF; Case Length: 1 mm; Dielectric: X7R; Case Height: 0.5 mm; Temperature Coefficient / Code: +/- 15 %; Value: 100nF, 16V; Supplier 1: Mouser; Supplier Part Number 1: 81-GRM155R71C104KA88; Case Code - in: 0402; RoHS: RoHS Compliant; Operating Temperature Range: - 55 C to + 125 C; Series: GRM; Termination Style: SMD/SMT; Package / Case: 0402 (1005 metric); Voltage Rating DC: 16 V; Maximum Operating Temperature: + 125 C; Case Code - mm: 1005; Minimum Operating Temperature: - 55 C; Product Category: Low & Medium Capacitance SMD Ceramic Chip Capacitors; Packaging: Reel; Product: General Type MLCCs; Category: Multilayer Ceramic Capacitors MLCC - SMD/SMT; Brand: Murata Electronics; Case Width: 0.5 mm; RoHS - Mouser: Y; Standard Pack Qty: 10000; Minimum Order Quantity: 1; Reeling: True; Manufacturer Part Number 1: GRM155R71C104KA88D
C322 C323 C330 C331 = Cap_0402: Manufacturer Part Number 1: CC0402JRNPO9BN101; Manufacturer: Yageo; Part Description: 100pF ±5% 50V C0G, NP0 Ceramic Capacitor -55°C ~ 125°C Surface Mount, MLCC 0402 (1005 Metric) 0.039" L x 0.020" W (1.00mm x 0.50mm); Temperature Coefficient: C0G, NP0; Tolerance: ±5%; Value: 100pF, 50V; Supplier 1: Digi-Key; Supplier Part Number 1: 311-1024-1-ND; RoHS: RoHS Compliant; Category: Capacitors; Applications: General Purpose; Mounting Type: Surface Mount, MLCC; Capacitance: 100pF; Ratings: -; Packaging: Cut Tape (CT); Voltage - Rated: 50V; Size / Dimension: 0.039" L x 0.020" W (1.00mm x 0.50mm); Height - Seated (Max): -; Package / Case: 0402 (1005 Metric); Operating Temperature: -55°C ~ 125°C; Features: -; Lead Spacing: -; Lead Style: -; Thickness (Max): 0.022" (0.55mm)
C326 C327 = Cap_0402: Manufacturer Part Number 1: CC0402JRNPO9BN101; Manufacturer: Yageo; Part Description: 100pF ±5% 50V C0G, NP0 Ceramic Capacitor -55°C ~ 125°C Surface Mount, MLCC 0402 (1005 Metric) 0.039" L x 0.020" W (1.00mm x 0.50mm); Voltage - Rated: 50V; Temperature Coefficient: C0G, NP0; Value: 100pF, 5%; Supplier 1: Digi-Key; Supplier Part Number 1: 311-1024-1-ND; RoHS: RoHS Compliant; Category: Capacitors; Applications: General Purpose; Mounting Type: Surface Mount, MLCC; Capacitance: 100pF; Ratings: -; Packaging: Cut Tape (CT); Size / Dimension: 0.039" L x 0.020" W (1.00mm x 0.50mm); Height - Seated (Max): -; Package / Case: 0402 (1005 Metric); Operating Temperature: -55°C ~ 125°C; Features: -; Tolerance: ±5%; Lead Spacing: -; Lead Style: -; Thickness (Max): 0.022" (0.55mm)
C333 C350 C351 C355-C357 = Cap_0603: Manufacturer Part Number 1: GRM155R71C104KA88D; Part Description: 0.10µF ±10% 16V X7R Ceramic Capacitor -55°C ~ 125°C Surface Mount, MLCC 0402 (1005 Metric) 0.039" L x 0.020" W (1.00mm x 0.50mm); Brand: Murata Electronics; Type: General Purpose MLCC; Capacitance: 0.1 uF; Temperature Coefficient / Code: +/- 15 %; Voltage Rating DC: 16 V; Supplier 1: Mouser; Supplier Part Number 1: 81-GRM155R71C104KA88; Tolerance: 10 %; Case Code - in: 0402; Manufacturer: Murata Electronics; Category: Multilayer Ceramic Capacitors MLCC - SMD/SMT; Value: 100nF, 10%; Manufacturer Part Number: GRM155R71C104KA88D; Maximum Operating Temperature: + 125 C; Minimum Operating Temperature: - 55 C; Minimum Order Quantity: 1; Operating Temperature Range: - 55 C to + 125 C; Package / Case: 0402 (1005 metric); Packaging: Reel; Product: General Type MLCCs; Product Category: Low & Medium Capacitance SMD Ceramic Chip Capacitors; Reeling: True; RoHS - Mouser: Y; RoHS: RoHS Compliant; Series: GRM; Standard Pack Qty: 10000; Termination Style: SMD/SMT
C334 C335 C338-C342 = Cap_0402: Manufacturer: Yageo; Manufacturer Part Number 1: CC0402JRNPO9BN101; Part Description: 100pF ±5% 50V C0G, NP0 Ceramic Capacitor -55°C ~ 125°C Surface Mount, MLCC 0402 (1005 Metric) 0.039" L x 0.020" W (1.00mm x 0.50mm); Voltage - Rated: 50V; Temperature Coefficient: C0G, NP0; Value: 100pF, 5%; Supplier 1: Digi-Key; Supplier Part Number 1: 311-1024-1-ND; Category: Capacitors; Features: -; Operating Temperature: -55°C ~ 125°C; Capacitance: 100pF; Thickness (Max): 0.022" (0.55mm); RoHS: RoHS Compliant; Lead Style: -; Ratings: -; Size / Dimension: 0.039" L x 0.020" W (1.00mm x 0.50mm); Height - Seated (Max): -; Applications: General Purpose; Package / Case: 0402 (1005 Metric); Lead Spacing: -; Packaging: Tape & Reel (TR); Mounting Type: Surface Mount, MLCC; Tolerance: ±5%
C344 C345 = Cap_0402: Manufacturer Part Number 1: GCM155R71H102KA37D; Part Description: 1000pF ±10% 50V X7R Ceramic Capacitor -55°C ~ 125°C Surface Mount, MLCC 0402 (1005 Metric) 0.039" L x 0.020" W (1.00mm x 0.50mm); Capacitance: 1000 pF; Type: Automotive Ultra Small MLCC; Brand: Murata Electronics; Case Height: 0.5 mm; Case Length: 1 mm; Dielectric: X7R; Voltage Rating DC: 50 V; Temperature Coefficient / Code: +/- 15 %; Value: 1nF, 10%; Supplier 1: Mouser; Supplier Part Number 1: 81-GCM155R71H102KA7D; Case Code - in: 0402; Package / Case: 0402 (1005 metric); Tolerance: 10 %; Termination Style: SMD/SMT; Packaging: Reel; Operating Temperature Range: - 55 C to + 125 C; Maximum Operating Temperature: + 125 C; Manufacturer: Murata Electronics; Category: Multilayer Ceramic Capacitors MLCC - SMD/SMT; RoHS: RoHS Compliant; Series: GCM; Case Width: 0.5 mm; Case Code - mm: 1005; Product: Automotive MLCCs; Standard Pack Qty: 10000; Reeling: True; RoHS - Mouser: Y; Minimum Order Quantity: 1; Product Category: Automotive Ceramic Chip Capacitors; Minimum Operating Temperature: - 55 C
C346-C348 = Cap_0402: Manufacturer: Yageo; Manufacturer Part Number 1: CC0402JRNPO9BN220; Part Description: 22pF ±5% 50V C0G, NP0 Ceramic Capacitor -55°C ~ 125°C Surface Mount, MLCC 0402 (1005 Metric) 0.039" L x 0.020" W (1.00mm x 0.50mm); Voltage - Rated: 50V; Temperature Coefficient: C0G, NP0; Value: 22pF, 5%; Supplier 1: Digi-Key; Supplier Part Number 1: 311-1018-2-ND; Tolerance: ±5%; Category: Capacitors; Packaging: Tape & Reel (TR); RoHS: RoHS Compliant; Capacitance: 22pF; Operating Temperature: -55°C ~ 125°C; Mounting Type: Surface Mount, MLCC; Height - Seated (Max): -; Size / Dimension: 0.039" L x 0.020" W (1.00mm x 0.50mm); Ratings: -; Applications: General Purpose; Thickness (Max): 0.022" (0.55mm); Lead Spacing: -; Lead Style: -; Features: -; Package / Case: 0402 (1005 Metric)
C349 = Cap_0402: Manufacturer Part Number 1: CC0402KRX7R9BB221; Manufacturer: Yageo; Part Description: 220pF ±10% 50V X7R Ceramic Capacitor -55°C ~ 125°C Surface Mount, MLCC 0402 (1005 Metric) 0.039" L x 0.020" W (1.00mm x 0.50mm); Temperature Coefficient: X7R; Voltage - Rated: 50V; Value: 220pF, 10%; Supplier 1: Digi-Key; Supplier Part Number 1: 311-1035-2-ND; Category: Capacitors; Ratings: -; RoHS: RoHS Compliant; Packaging: Tape & Reel (TR); Mounting Type: Surface Mount, MLCC; Applications: General Purpose; Capacitance: 220pF; Tolerance: ±10%; Operating Temperature: -55°C ~ 125°C; Package / Case: 0402 (1005 Metric); Lead Spacing: -; Size / Dimension: 0.039" L x 0.020" W (1.00mm x 0.50mm); Thickness (Max): 0.022" (0.55mm); Height - Seated (Max): -; Lead Style: -; Features: -
C352 = Cap_0402: Manufacturer Part Number 1: 04023A100JAT2A; Manufacturer: AVX; Part Description: 10pF ±5% 25V C0G, NP0 Ceramic Capacitor -55°C ~ 125°C Surface Mount, MLCC 0402 (1005 Metric) 0.039" L x 0.020" W (1.00mm x 0.50mm); Voltage Rating: 25; Ceramic Capacitor Case: 0402 [1005 Metric]; Capacitor Case Style: 0402 [1005 Metric]<!--FANDB--><div class="features-and-benefits-container"></div>; Dielectric Characteristic: C0G / NP0; SVHC: No SVHC (16-Jun-2014); Capacitance: 10; Value: 10pF, 5%; Supplier 1: Farnell; Supplier Part Number 1: 2332478RL; Capacitance Tolerance: ± 5%; Product Range: -; RoHS: YES; Operating Temperature Min: -55; Operating Temperature Max: 125; Capacitance Tolerance ±: ± 5%; MSL: MSL 1 - Unlimited; Packaging: Cut Tape
C353 C354 = Cap_0402: Manufacturer: AVX; Manufacturer Part Number 1: 04023A100JAT2A; Part Description: 10pF ±5% 25V C0G, NP0 Ceramic Capacitor -55°C ~ 125°C Surface Mount, MLCC 0402 (1005 Metric) 0.039" L x 0.020" W (1.00mm x 0.50mm); Capacitance: 10; Ceramic Capacitor Case: 0402 [1005 Metric]; Capacitor Case Style: 0402 [1005 Metric]<!--FANDB--><div class="features-and-benefits-container"></div>; Dielectric Characteristic: C0G / NP0; SVHC: No SVHC (16-Jun-2014); Voltage Rating: 25; Supplier 1: Farnell; Supplier Part Number 1: 2332478RL; Capacitance Tolerance: ± 5%; value: 10pF, 5%; Capacitance Tolerance ±: ± 5%; MSL: MSL 1 - Unlimited; Operating Temperature Max: 125; Operating Temperature Min: -55; Packaging: Cut Tape; Product Range: -; RoHS: YES
FR40-FR46 = Ferrite: Manufacturer Part Number 1: MPZ2012S601AT000; Manufacturer: TDK Corporation; Part Description: FERRITE BEAD 600 OHM 0805 1LN; Filter Type: Differential Mode - Single; Impedance @ Frequency: 600 Ohm @ 100MHz; DC Resistance (DCR): 100 mOhm Max; Supplier 1: Digi-Key; Supplier Part Number 1: 445-2206-2-ND; Mounting Type: Surface Mount; RoHS: RoHS Compliant; Height (Max): 0.041" (1.05mm); Packaging: Tape & Reel (TR); Category: Filters; Current Rating: 2A; Package / Case: 0805 (2012 Metric); Size / Dimension: 0.079" L x 0.049" W (2.00mm x 1.25mm)
IC16 = LMK00105: Manufacturer: Texas Instruments; Manufacturer Part Number 1: LMK00105SQ/NOPB; Part Description: IC CLK BUFFER 2:5 200MHZ 24WQFN; Frequency - Max: 200MHz; Voltage - Supply: 2.375 V ~ 3.45 V; Input: HCSL, LVCMOS, LVDS, LVPECL, LVTTL, SSTL, Crystal; Differential - Input:Output: Yes/No; Supplier 1: Digi-Key; Type: Fanout Buffer (Distribution), Multiplexer, Translator; Category: Integrated Circuits (ICs); Operating Temperature: -40°C ~ 85°C; Package / Case: 24-WFQFN Exposed Pad; Supplier Device Package: 24-WQFN (4x4); Supplier Part Number 1: LMK00105SQ/NOPBCT-ND
IC17 = NC7SV74K8XCT: Manufacturer: Fairchild Semiconductor; Part Description: IC D-TYPE POS TRG SNGL US8; Max Propagation Delay @ V, Max CL: 2.8ns @ 3.3V, 30pF; Frequency - Clock: 200MHz; Current - Output High, Low: 24mA, 24mA; Current - Quiescent: 0.9µA; Number of Bits per Element: 1; Trigger Type: Positive Edge; Output Type: Differential; Function: Set(Preset) and Reset; Input Capacitance: 2pF; Voltage - Supply: 0.9 V ~ 3.6 V; Supplier 1: Digi-Key; Operating Temperature: -40°C ~ 85°C (TA); Mounting Type: Surface Mount; Package / Case: 8-VFSOP (0.091", 2.30mm Width); Packaging: Cut Tape (CT); Number of Elements: 1; Manufacturer Part Number 1: NC7SV74K8X; RoHS: RoHS Compliant; Type: D-Type; Category: Integrated Circuits (ICs); Supplier Part Number 1: NC7SV74K8XCT-ND
IC18 = AD5601BKSZ-REEL7: Single 8-Bit nanoDAC with SPI Interface in LFCSP and SC70, 2.7 to 5.5 V, <100 uA, -40 to +125 degC, KS-6, Pb-Free, Reel; Generic Part Number: AD5601; Manufacturer: Analog Devices; Part Description: IC DAC 8BIT BUFF V-OUT SC70-6; # DAC Outputs: 1; Max V+: 5.5V; Op Pwr Diss: 550µW; Resolution (Bits): 8; Settling Time: 6µs; Single Supply: Yes; DatasheetVersion: Rev.F; PackageVersion: 072809-A; PackageReference: KS-6; PackageDescription: 6-Lead Thin Shrink Small Outline Transistor Package [SC70]; Supplier 1: Digi-Key; Supplier Part Number 1: AD5601BKSZ-REEL7TR-ND; Supplier 2: Digi-Key; Supplier Part Number 2: AD5601BKSZ-REEL7CT-ND; Supplier 3: Digi-Key; Supplier Part Number 3: AD5601BKSZ-REEL7DKR-ND; Supplier 4: Farnell; Supplier Part Number 4: 2312971; Supplier 5: Newark; Supplier Part Number 5: 59K4256; Supplier 6: Newark; Supplier Part Number 6: 67W3160; Supplier 7: Mouser; Supplier Part Number 7: 584-AD5601BKSZ-R7; Packing: Reel; RoHS: Y; Mounting Technology: Surface Mount; Code_JEDEC: MO-203-AB; PartNumber: AD5601BKSZ-REEL7; ComponentLink1Description: Manufacturer URL; ComponentLink1URL: http://www.analog.com/en/index.html; ComponentLink2Description: Datasheet; ComponentLink2URL: http://www.analog.com/static/imported-files/data_sheets/AD5601_5611_5621.pdf; ComponentLink3Description: Package Specification; ComponentLink3URL: http://www.analog.com/static/imported-files/packages/PKG_PDF/SC70(KS)/KS_6.pdf; ComponentLink4Description: Product URL; ComponentLink4URL: http://www.analog.com/en/digital-to-analog-converters/da-converters/ad5601/products/product.html
IC19 = ADF4002: Manufacturer: Analog Devices Inc; Manufacturer Part Number 1: ADF4002BCPZ-RL7; Part Description: IC PLL FREQUENCY SYNTH 20-LFCSP; Ratio - Input:Output: 2:1; Differential - Input:Output: Yes/No; Input: CMOS, TTL; Voltage - Supply: 2.7 V ~ 3.3 V; Supplier 1: Digi-Key; Supplier: Digi-Key; Category: Integrated Circuits (ICs); Type: Clock/Frequency Synthesizer (RF), Phase Detector; Operating Temperature: -40°C ~ 85°C; Mounting Type: Surface Mount; Package / Case: 20-VFQFN Exposed Pad, CSP; Supplier Part Number 1: ADF4002BCPZ-RL7CT-ND
IC20 = Si5351C: Manufacturer Part Number 1: SI5351C-B-GM; Manufacturer: Silicon Labs; Part Description: IC CLK GENERATOR 200MHZ 20QFN; PLL: Yes; Input: Clock, Crystal; Output: LVCMOS; Number of Circuits: 1; Ratio - Input:Output: 2:8; Differential - Input:Output: No/No; Frequency - Max: 160MHz; Divider/Multiplier: Yes/No; Voltage - Supply: 1.71 V ~ 3.6 V; Supplier 1: Digi-Key; Supplier Part Number 1: 336-2402-5-ND; Category: Integrated Circuits (ICs); RoHS: RoHS Compliant; Packaging: Tube; Type: Clock Generator; Operating Temperature: -40°C ~ 85°C; Mounting Type: Surface Mount; Package / Case: 20-VFQFN Exposed Pad; Supplier Device Package: 20-QFN (4x4)
J15 J16 = RF_IF_connector: Manufacturer: Molex, LLC; Manufacturer Part Number 1: 0734120110; Part Description: CONN UMC RCPT STR 50 OHM SMD; Shield Termination: Solder; Frequency - Max: 6GHz; Impedance: 50 Ohm; Center Contact Material: Brass; Connector Style: Ultra Miniature Coaxial; Connector Type: Jack, Male Pin; Dielectric Material: Liquid Crystal Polymer (LCP); Center Contact Plating: Gold; Body Finish: Nickel; Body Material: Phosphor Bronze; Voltage Rating: 60V; Supplier 1: Digi-Key; Supplier Part Number 1: WM5587CT-ND; Ingress Protection: -; Category: Connectors, Interconnects; Mounting Type: Surface Mount; Packaging: Cut Tape (CT); Operating Temperature: -40°C ~ 90°C; Housing Color: Silver; Features: -; RoHS: RoHS Compliant; Cable Group: -; Fastening Type: Snap-On; Contact Termination: Solder
R106-R108 R110-R121 R125 R127 R128 = Res_0402: Manufacturer Part Number 1: RC0402JR-070RL; Manufacturer: Yageo; Part Description: RES SMD 0.0OHM JUMPER 1/16W 0402; Resistance (Ohms): 0.0; Tolerance: Jumper; Power (Watts): 0.063W, 1/16W; Value: 0R; Supplier 1: Digi-Key; Supplier Part Number 1: 311-0.0JRTR-ND; Category: Resistors; Temperature Coefficient: -; Features: Moisture Resistant; Supplier Device Package: 0402; Height: 0.016" (0.40mm); Package / Case: 0402 (1005 Metric); Operating Temperature: -55°C ~ 155°C; Size / Dimension: 0.039" L x 0.020" W (1.00mm x 0.50mm); Composition: Thick Film; Packaging: Tape & Reel (TR); Number of Terminations: 2; RoHS: RoHS Compliant
R109 R122 R129 R133-R135 = Res_0402: Manufacturer: Samsung Electro-Mechanics America, Inc.; Manufacturer Part Number: RC1005F49R9CS; Part Description: RES SMD 49.9 OHM 1% 1/16W 0402; Temperature Coefficient: ±100ppm/°C; Resistance (Ohms): 49.9; Power (Watts): 0.063W, 1/16W; Number of Terminations: 2; Size / Dimension: 0.039" L x 0.020" W (1.00mm x 0.50mm); Supplier Device Package: 0402 (1005 Metric); RoHS: RoHS Compliant; Supplier Part Number 1: 1276-3469-6-ND; Features: -; Packaging: Digi-Reel®; Tolerance: ±1%; Height: 0.016" (0.40mm); Category: Resistors; Composition: Thick Film; Package / Case: 0402 (1005 Metric); Supplier 1: Digi-Key; Operating Temperature: -55°C ~ 155°C; Value: 49.9R, 1%
R123 = Res_0402: Manufacturer Part Number 1: RC0402JR-0710RL; Manufacturer: Yageo; Part Description: RES SMD 10 OHM 5% 1/16W 0402; Power (Watts): 0.063W, 1/16W; Resistance (Ohms): 10; Temperature Coefficient: ±200ppm/°C; Value: 10R, 5%; Supplier 1: Digi-Key; Supplier Part Number 1: 311-10JRTR-ND; Number of Terminations: 2; Height: 0.016" (0.40mm); RoHS: RoHS Compliant; Composition: Thick Film; Packaging: Tape & Reel (TR); Category: Resistors; Supplier Device Package: 0402; Features: Moisture Resistant; Tolerance: ±5%; Operating Temperature: -55°C ~ 155°C; Size / Dimension: 0.039" L x 0.020" W (1.00mm x 0.50mm); Package / Case: 0402 (1005 Metric)
R124 = Res_0402: Manufacturer: Stackpole Electronics Inc; Manufacturer Part Number 1: RMCF0402FT1K00; Part Description: RES SMD 1K OHM 1% 1/16W 0402; Temperature Coefficient: ±100ppm/°C; Power (Watts): 0.063W, 1/16W; Value: 1k, 1%; Supplier 1: Digi-Key; Supplier Part Number 1: RMCF0402FT1K00TR-ND; Resistance (Ohms): 1k; Packaging: Tape & Reel (TR); Category: Resistors; RoHS: RoHS Compliant; Tolerance: ±1%; Height: 0.016" (0.40mm); Number of Terminations: 2; Package / Case: 0402 (1005 Metric); Operating Temperature: -55°C ~ 155°C; Features: -; Composition: Thick Film; Supplier Device Package: 0402; Size / Dimension: 0.039" L x 0.020" W (1.00mm x 0.50mm)
R126 = Res_0402: Manufacturer: Panasonic Electronic Components; Manufacturer Part Number 1: ERA-2AED471X; Part Description: RES SMD 470 OHM 0.5% 1/16W 0402; Power (Watts): 0.063W, 1/16W; Temperature Coefficient: ±25ppm/°C; Resistance (Ohms): 470; Value: 470R, 0.5%; Supplier 1: Digi-Key; Supplier Part Number 1: P470DETR-ND; Tolerance: ±0.5%; Packaging: Tape & Reel (TR); Number of Terminations: 2; Operating Temperature: -55°C ~ 155°C; RoHS: RoHS Compliant; Size / Dimension: 0.039" L x 0.020" W (1.00mm x 0.50mm); Composition: Thin Film; Package / Case: 0402 (1005 Metric); Height: 0.016" (0.40mm); Features: Automotive AEC-Q200; Supplier Device Package: 0402; Category: Resistors
R130 R131 = Res_0402: Manufacturer: Yageo; Manufacturer Part Number 1: RC0402FR-0710KL; Part Description: RES SMD 10K OHM 1% 1/16W 0402; Temperature Coefficient: ±100ppm/°C; Power (Watts): 0.063W, 1/16W; Value: 10k, 1%; Supplier 1: Digi-Key; Supplier Part Number 1: 311-10.0KLRTR-ND; Resistance (Ohms): 10k; Packaging: Tape & Reel (TR); RoHS: RoHS Compliant; Package / Case: 0402 (1005 Metric); Tolerance: ±1%; Operating Temperature: -55°C ~ 155°C; Size / Dimension: 0.039" L x 0.020" W (1.00mm x 0.50mm); Number of Terminations: 2; Category: Resistors; Height: 0.016" (0.40mm); Supplier Device Package: 0402; Features: Moisture Resistant; Composition: Thick Film
R132 = Res_0402: Manufacturer: Yageo; Manufacturer Part Number 1: RC0402JR-07330RL; Part Description: RES SMD 330 OHM 5% 1/16W 0402; Power (Watts): 0.063W, 1/16W; Resistance (Ohms): 330; Temperature Coefficient: ±100ppm/°C; Value: 330R, 5%; Supplier 1: Digi-Key; Supplier Part Number 1: 311-330JRTR-ND; Composition: Thick Film; Supplier Device Package: 0402; Package / Case: 0402 (1005 Metric); Size / Dimension: 0.039" L x 0.020" W (1.00mm x 0.50mm); Features: Moisture Resistant; Height: 0.016" (0.40mm); Packaging: Tape & Reel (TR); RoHS: RoHS Compliant; Tolerance: ±5%; Category: Resistors; Number of Terminations: 2; Operating Temperature: -55°C ~ 155°C
XO1 = RPT7050A: Manufacturer Part Number 1: E6245LF; Part Description: TCXO 30.72MHz, E6245LF; Manufacturer: Rakon; Supplier 1: Rakon; Supplier Part Number 1: E6245LF
XO2 = TXCO: Manufacturer Part Number 1: E5280LF; Part Description: TCXO 30.72MHz, E5280LF; Manufacturer: Rakon; Supplier 1: Rakon; Supplier Part Number 1: E5280LF
XT1 = CRYSTAL_19M2: Oscillator Crystal 25 MHz; Manufacturer Part Number 1: ABM8-25.000MHZ-B2-T; Manufacturer: ABRACON; Part Description: 25MHz ±20ppm Crystal 18pF 50 Ohm -20°C ~ 70°C Surface Mount 4-SMD, No Lead (DFN, LCC); Supplier 1: Newark; Supplier Part Number 1: 13J1767